# Altium schematic sheet 20_CLOCKS.SchDoc
size A3; DocumentNumber: 20; SheetNumber: 20; SheetTotal: 21
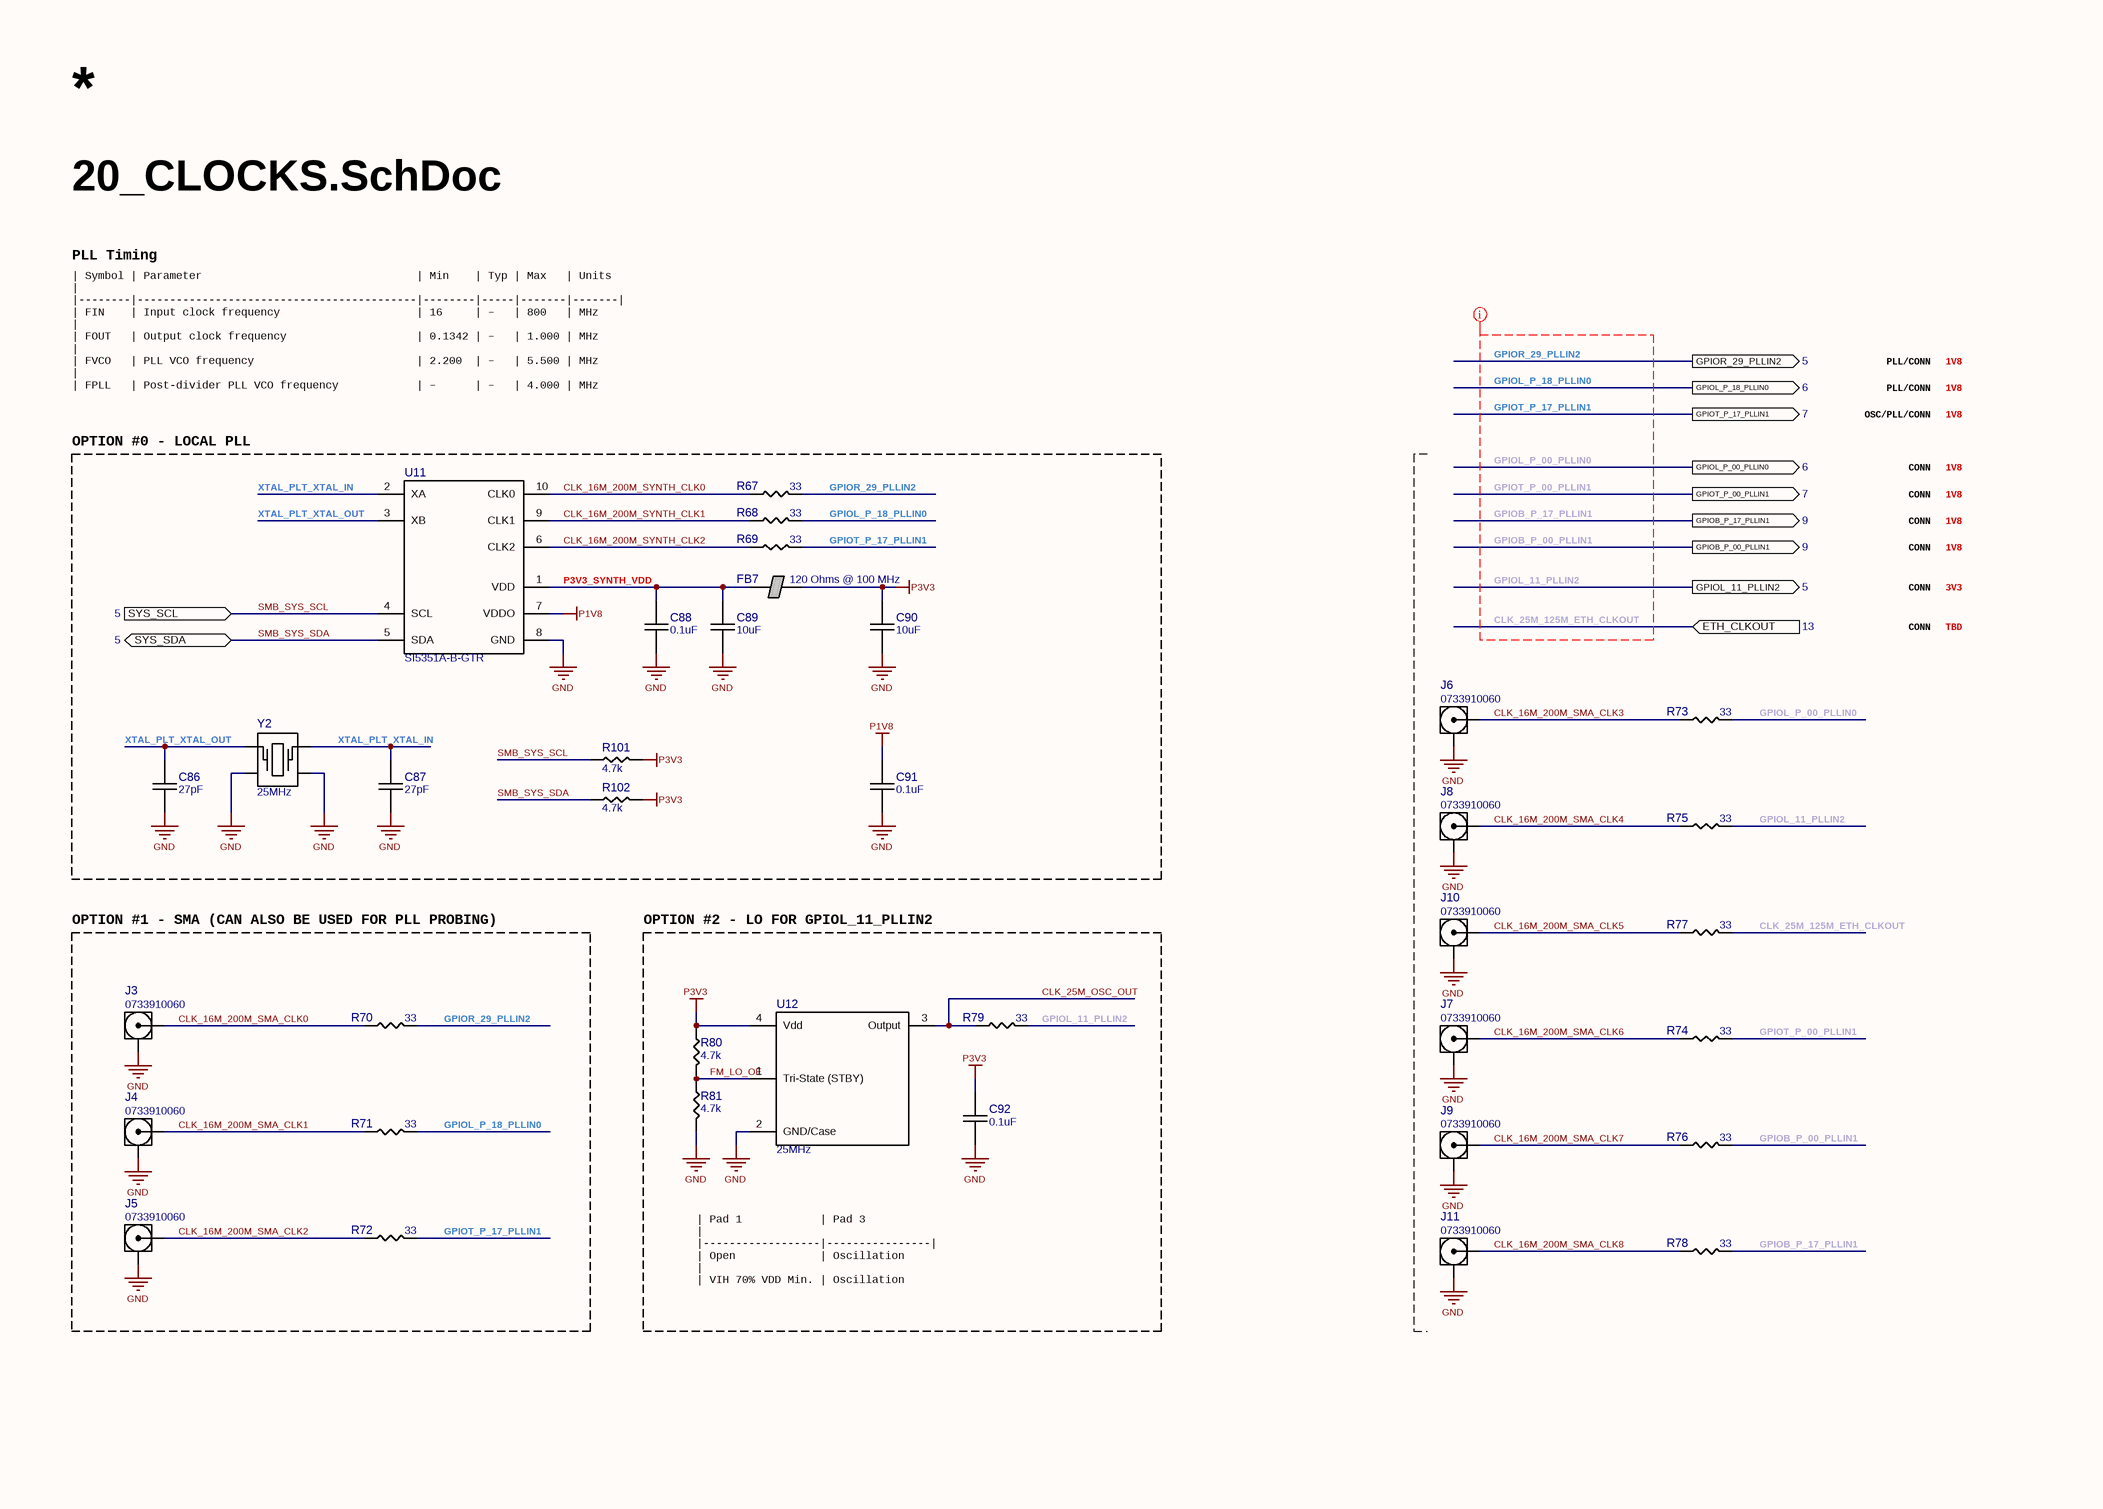
[diagram p0: 20_CLOCKS.SchDoc]

## Parts
C86  27pF  [CAPC1005X06N]
C87  27pF  [CAPC1005X06N]
C88  0.1uF  [CAPC1005X06N]
C89  10uF  [CAPC1005X06N]
C90  10uF  [CAPC1005X06N]
C91  0.1uF  [CAPC1005X06N]
C92  0.1uF  [CAPC1005X06N]
FB7  120 Ohms @ 100 MHz  [INDC1005X05N]
J3  0733910060  [MOLEX_0733910060]
J4  0733910060  [MOLEX_0733910060]
J5  0733910060  [MOLEX_0733910060]
J6  0733910060  [MOLEX_0733910060]
J7  0733910060  [MOLEX_0733910060]
J8  0733910060  [MOLEX_0733910060]
J9  0733910060  [MOLEX_0733910060]
J10  0733910060  [MOLEX_0733910060]
J11  0733910060  [MOLEX_0733910060]
R67  33  [RESC1005X03N]
R68  33  [RESC1005X03N]
R69  33  [RESC1005X03N]
R70  33  [RESC1005X03N]
R71  33  [RESC1005X03N]
R72  33  [RESC1005X03N]
R73  33  [RESC1005X03N]
R74  33  [RESC1005X03N]
R75  33  [RESC1005X03N]
R76  33  [RESC1005X03N]
R77  33  [RESC1005X03N]
R78  33  [RESC1005X03N]
R79  33  [RESC1005X03N]
R80  4.7k  [RESC1005X03N]
R81  4.7k  [RESC1005X03N]
R101  4.7k  [RESC1005X03N]
R102  4.7k  [RESC1005X03N]
U11  SI5351A-B-GTR  [TSSOP50P490X110-10N]
U12  25MHz  [XTAL_2520]
Y2  25MHz  [XTAL_3225]

## Blocks framed on the sheet
OPTION #0 - LOCAL PLL: C86-C91 FB7 R67-R69 R101 R102 U11 Y2
OPTION #1 - SMA (CAN ALSO BE USED FOR PLL PROBING): J3-J5 R70-R72
OPTION #2 - LO FOR GPIOL_11_PLLIN2: C92 R79-R81 U12

## Ports
ETH_CLKOUT (in, see 13), GPIOB_P_00_PLLIN1 (out, see 9), GPIOB_P_17_PLLIN1 (out, see 9), GPIOL_11_PLLIN2 (out, see 5), GPIOL_P_00_PLLIN0 (out, see 6), GPIOL_P_18_PLLIN0 (out, see 6), GPIOR_29_PLLIN2 (out, see 5), GPIOT_P_00_PLLIN1 (out, see 7), GPIOT_P_17_PLLIN1 (out, see 7), SYS_SCL (in, see 5), SYS_SDA (bidir, see 5)

## Nets
GND: C86.1 C87.1 C88.1 C89.1 C90.1 C91.1 C92.1 J3.2 J4.2 J5.2 J6.2 J7.2 J8.2 J9.2 J10.2 J11.2 R81.2 U11.8(GND) U12.2(GND/Case) Y2.2 Y2.4
P1V8: C91.2 U11.7(VDDO)
P3V3: C90.2 C92.2 FB7.2 R80.1 R101.2 R102.2 U12.4(Vdd)
CLK_16M_200M_SMA_CLK0: J3.1 R70.1
CLK_16M_200M_SMA_CLK1: J4.1 R71.1
CLK_16M_200M_SMA_CLK2: J5.1 R72.1
CLK_16M_200M_SMA_CLK3: J6.1 R73.1
CLK_16M_200M_SMA_CLK4: J8.1 R75.1
CLK_16M_200M_SMA_CLK5: J10.1 R77.1
CLK_16M_200M_SMA_CLK6: J7.1 R74.1
CLK_16M_200M_SMA_CLK7: J9.1 R76.1
CLK_16M_200M_SMA_CLK8: J11.1 R78.1
CLK_16M_200M_SYNTH_CLK0: R67.1 U11.10(CLK0)
CLK_16M_200M_SYNTH_CLK1: R68.1 U11.9(CLK1)
CLK_16M_200M_SYNTH_CLK2: R69.1 U11.6(CLK2)
CLK_25M_125M_ETH_CLKOUT: R77.2 ; port ETH_CLKOUT
CLK_25M_OSC_OUT: R79.1 U12.3(Output)
FM_LO_OE: R80.2 R81.1 U12.1(Tri-State_(STBY))
GPIOB_P_00_PLLIN1: R76.2 ; port GPIOB_P_00_PLLIN1
GPIOB_P_17_PLLIN1: R78.2 ; port GPIOB_P_17_PLLIN1
GPIOL_11_PLLIN2: R75.2 R79.2 ; port GPIOL_11_PLLIN2
GPIOL_P_00_PLLIN0: R73.2 ; port GPIOL_P_00_PLLIN0
GPIOL_P_18_PLLIN0: R68.2 R71.2 ; port GPIOL_P_18_PLLIN0
GPIOR_29_PLLIN2: R67.2 R70.2 ; port GPIOR_29_PLLIN2
GPIOT_P_00_PLLIN1: R74.2 ; port GPIOT_P_00_PLLIN1
GPIOT_P_17_PLLIN1: R69.2 R72.2 ; port GPIOT_P_17_PLLIN1
P3V3_SYNTH_VDD: C88.2 C89.2 FB7.1 U11.1(VDD)
SMB_SYS_SCL: R101.1 U11.4(SCL) ; port SYS_SCL
SMB_SYS_SDA: R102.1 U11.5(SDA) ; port SYS_SDA
XTAL_PLT_XTAL_IN: C87.2 U11.2(XA) Y2.3
XTAL_PLT_XTAL_OUT: C86.2 U11.3(XB) Y2.1

## Layout directives
net class CLK: CLK_25M_125M_ETH_CLKOUT, GPIOB_P_00_PLLIN1, GPIOB_P_17_PLLIN1, GPIOL_11_PLLIN2, GPIOL_P_00_PLLIN0, GPIOL_P_18_PLLIN0, GPIOR_29_PLLIN2, GPIOT_P_00_PLLIN1, GPIOT_P_17_PLLIN1

## Notes on the sheet
- PLL Timing
- | Symbol | Parameter                                 | Min    | Typ | Max   | Units |
  |--------|-------------------------------------------|--------|-----|-------|-------|
  | FIN    | Input clock frequency                     | 16     | –   | 800   | MHz   |
  | FOUT   | Output clock frequency                    | 0.1342 | –   | 1.000 | MHz   |
  | FVCO   | PLL VCO frequency                         | 2.200  | –   | 5.500 | MHz   |
  | FPLL   | Post-divider PLL VCO frequency            | –      | –   | 4.000 | MHz   |
  | FPFD   | Phase frequency detector input frequency  | 16     | –   | 800   | MHz   |
- PLL/CONN
- 1V8
- OSC/PLL/CONN
- CONN
- 3V3
- TBD
- | Pad 1            | Pad 3          |
  |------------------|----------------|
  | Open             | Oscillation    |
  | VIH 70% VDD Min. | Oscillation    |
  | VIL 30% VDD Max. | No Oscillation |

## Library data of the parts
C86 C87 = CC0402JRNPO9BN270: CAP CER 27PF 50V C0G/NPO 0402; Manufacturer 1: Yageo; Tol: 5%; TempC: C0G/NP0; Part Number: CC0402JRNPO9BN270; Value: 27pF; Voltage: 50V; Manufacturer Part Number 1: CC0402JRNPO9BN270; Supplier 1: Digi-Key; Supplier Part Number 1: 311-1019-1-ND
C88 C91 C92 = GRM155R71E104KE14J: CAP CER 0.1UF 25V X7R 0402; Manufacturer 1: Murata Electronics; Tol: 10%; Part Number: GRM155R71E104KE14J; Value: 0.1uF; Voltage: 25V; TempC: X7R; Manufacturer Part Number 1: GRM155R71E104KE14J; Supplier 1: Digi-Key; Supplier Part Number 1: 490-14603-1-ND
C89 C90 = GRM155R60J106ME47D: CAP CER 10UF 6.3V X5R 0402; Manufacturer 1: Murata Electronics; Tol: 20%; Part Number: GRM155R60J106ME47D; Value: 10uF; Voltage: 6.3V; TempC: X5R; Manufacturer Part Number 1: GRM155R60J106ME47D; Supplier 1: Digi-Key; Supplier Part Number 1: 490-13239-1-ND
FB7 = BLM15PD121SN1D: FERRITE BEAD 120 OHM 0402 1LN; Manufacturer 1: Murata Electronics; DCR: 90mOhm; Ir: 1.3A; Part Number: BLM15PD121SN1D; Value: 120 Ohms @ 100 MHz; Manufacturer Part Number 1: BLM15PD121SN1D; Supplier 1: Digi-Key; Supplier Part Number 1: 490-5203-1-ND
J3-J11 = 0733910060: CONN SMA RCPT STR 50 OHM PCB; Manufacturer 1: Molex; Part Number: 0733910060; Manufacturer Part Number 1: 0733910060; Supplier 1: Digi-Key; Supplier Part Number 1: WM5543-ND
R67-R79 = RC0402FR-0733RL: RES SMD 33 OHM 1% 1/16W 0402; Manufacturer 1: Yageo; Part Number: RC0402FR-0733RL; Value: 33; Tol: 1%; Manufacturer Part Number 1: RC0402FR-0733RL; Supplier 1: Digi-Key; Supplier Part Number 1: 311-33.0LRCT-ND
R80 R81 R101 R102 = RC0402FR-074K7L: RES SMD 4.7K OHM 1% 1/16W 0402; Manufacturer 1: Yageo; Part Number: RC0402FR-074K7L; Value: 4.7k; Tol: 1%; Manufacturer Part Number 1: RC0402FR-074K7L; Supplier 1: Digi-Key; Supplier Part Number 1: 311-4.7KLRCT-ND
U11 = SI5351A-B-GTR: IC CLK GENERATOR 200MHZ 10MSOP; Manufacturer 1: Skyworks Solutions Inc.; Part Number: SI5351A-B-GTR; Manufacturer Part Number 1: SI5351A-B-GTR; Supplier 1: Digi-Key; Supplier Part Number 1: 336-3908-1-ND
U12 = ECS-2033-250-BN: XTAL OSC XO 25.0000MHZ CMOS SMD; Manufacturer 1: ECS Inc.; Part Number: ECS-2033-250-BN; Value: 25MHz; Manufacturer Part Number 1: ECS-2033-250-BN; Supplier 1: Digi-Key; Supplier Part Number 1: XC1433CT-ND
Y2 = TSX-3225 25.0000MF10P-C0: CRYSTAL 25.0000MHZ 18PF SMD; Manufacturer 1: EPSON; Part Number: TSX-3225 25.0000MF10P-C0; Value: 25MHz; Manufacturer Part Number 1: TSX-3225 25.0000MF10P-C0; Supplier 1: Digi-Key; Supplier Part Number 1: SER4211TR-ND